# EAGLE schematic E-cabinet (EAGLE 6.6.0)
AUFTRAGS_NR: EL-Dummy; BEARBEITET: J.Strassesr; DATUM: 23.01.2016; ERSTELLER: J.Strasser

## Sheet 1 of 3
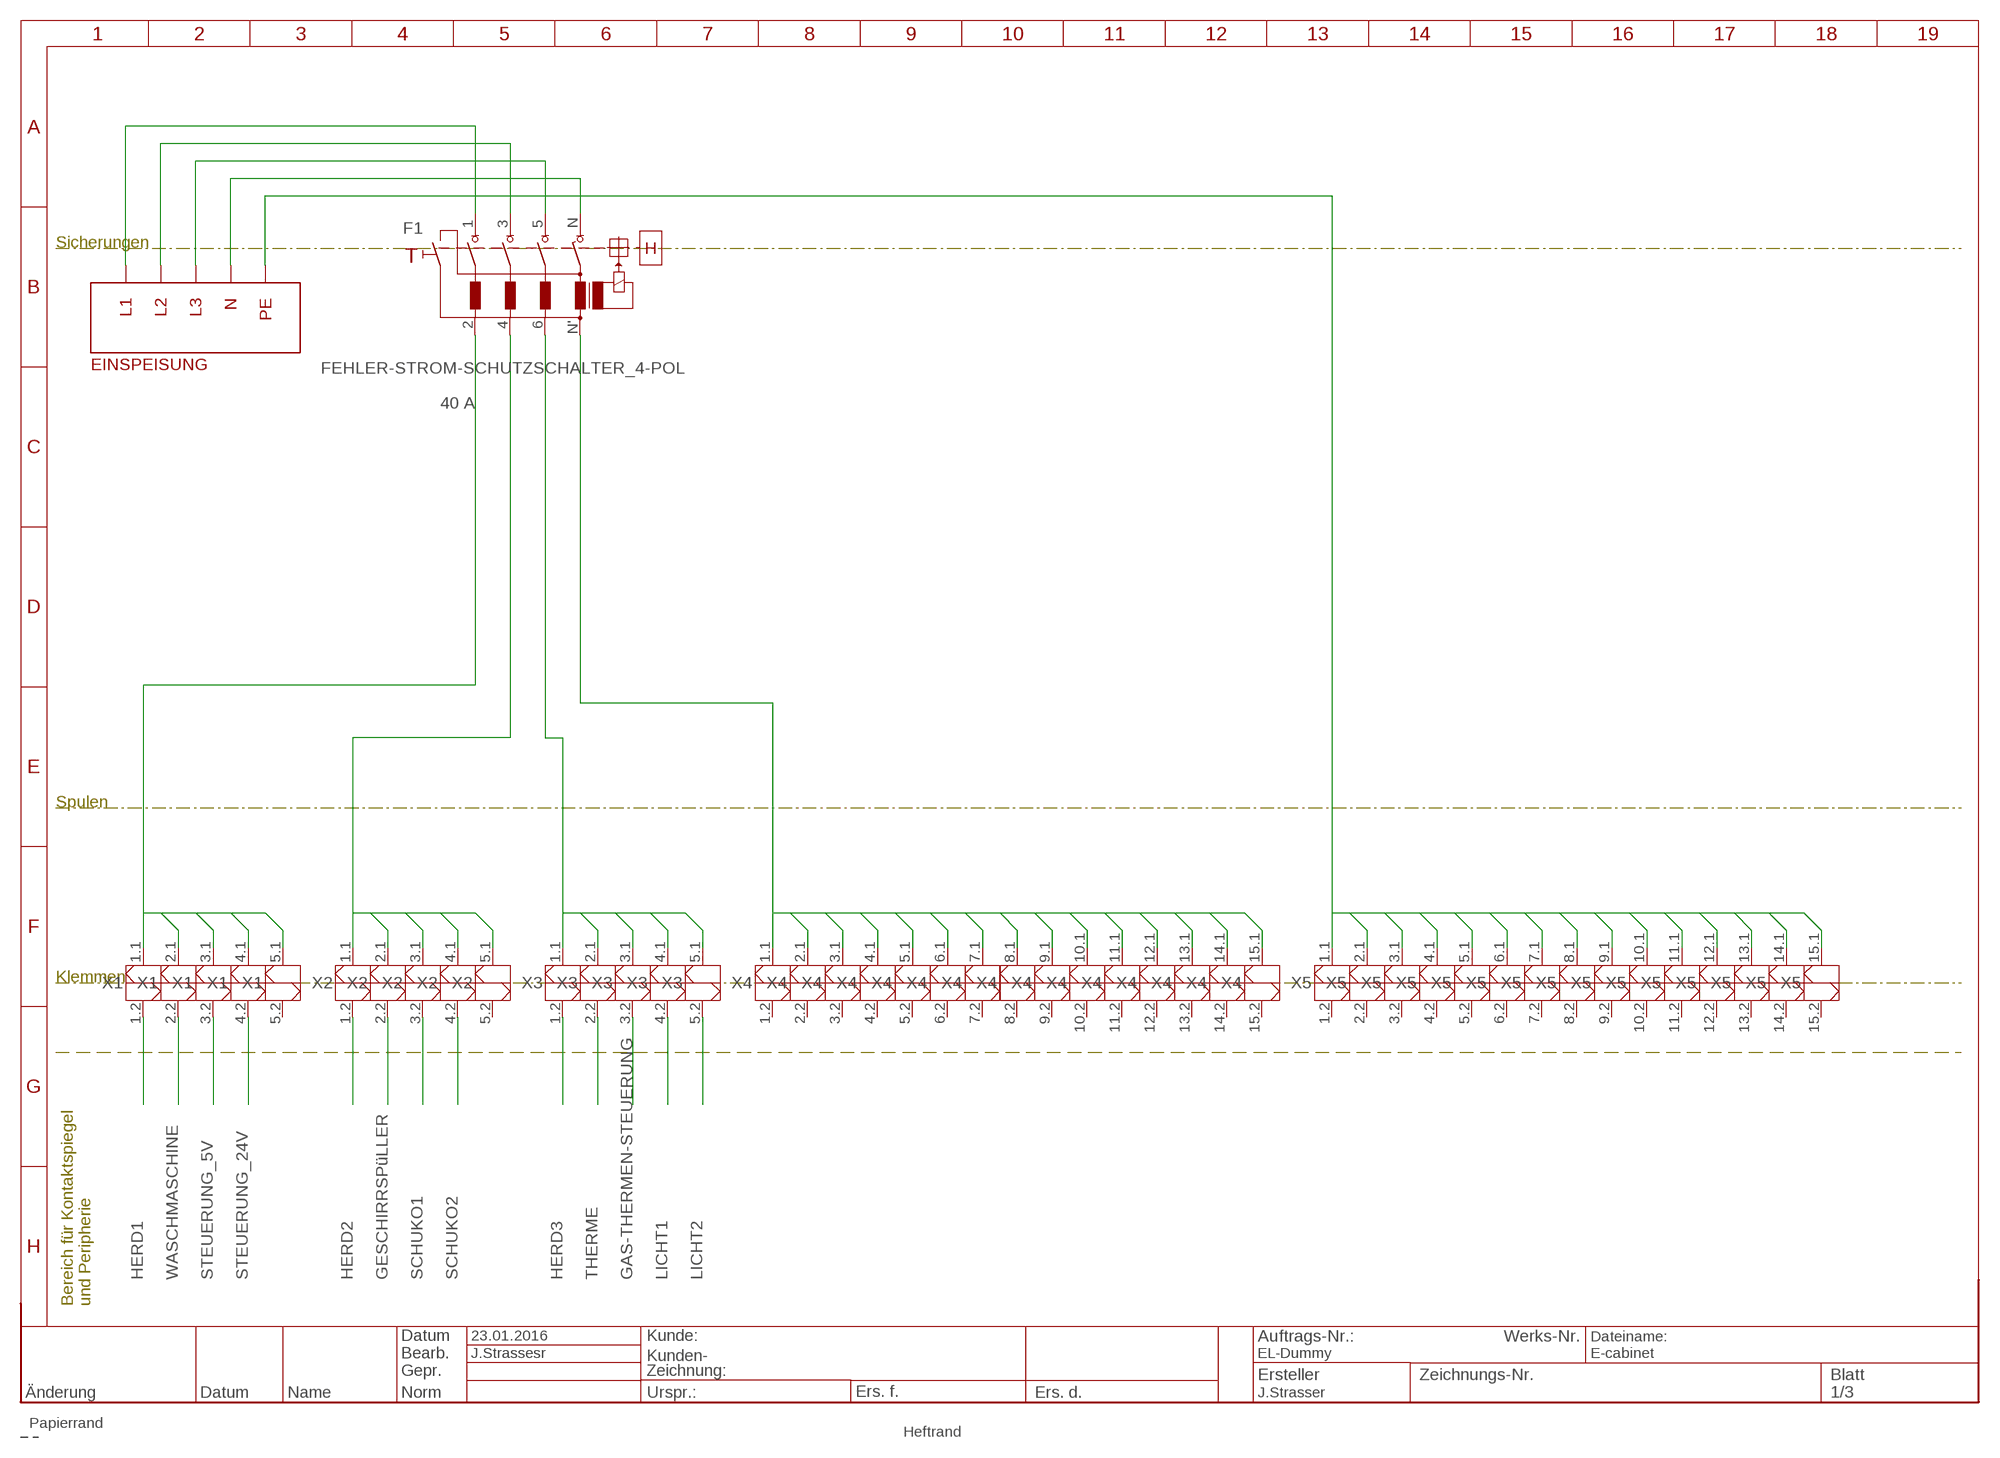
[diagram p0: schematic, sheet 1]

### Parts
F1  FEHLER-STROM-SCHUTZSCHALTER_4-POL  [FEHLER-STROM-SCHUTZSCHALTER_4-POL]
X1  KLEMME-2_5-BRUECKE  [KLEMME-2_5-BRUECKE]
X2  KLEMME-2_5-BRUECKE  [KLEMME-2_5-BRUECKE]
X3  KLEMME-2_5-BRUECKE  [KLEMME-2_5-BRUECKE]
X4  KLEMME-2_15-BRUECKE  [KLEMME-2_15-BRUECKE]
X5  KLEMME-2_15-BRUECKE  [KLEMME-2_15-BRUECKE]

### Nets
GAS-THERMEN-STEUERUNG: X3.3.2 ; also sheet 2
GESCHIRRSPüLLER: X2.2.2 ; also sheet 2
HERD1: X1.1.2 ; also sheet 2
HERD2: X2.1.2 ; also sheet 2
HERD3: X3.1.2 ; also sheet 2
L1: F1.2 X1.1.1 X1.2.1 X1.3.1 X1.4.1 X1.5.1
L1-EXT: F1.1
L2: F1.4 X2.1.1 X2.2.1 X2.3.1 X2.4.1 X2.5.1
L2-EXT: F1.3
L3-EXT: F1.5
LICHT1: X3.4.2 ; also sheet 2
LICHT2: X3.5.2 ; also sheet 2
N: F1.N' X4.1.1 X4.2.1 X4.3.1 X4.4.1 X4.5.1 X4.6.1 X4.7.1 X4.8.1 X4.9.1 X4.10.1 X4.11.1 X4.12.1 X4.13.1 X4.14.1 X4.15.1 ; also sheet 2
N$1: F1.6 X3.1.1 X3.2.1 X3.3.1 X3.4.1 X3.5.1
N-EXT: F1.N
PE-EXT: X5.1.1 X5.2.1 X5.3.1 X5.4.1 X5.5.1 X5.6.1 X5.7.1 X5.8.1 X5.9.1 X5.10.1 X5.11.1 X5.12.1 X5.13.1 X5.14.1 X5.15.1
SCHUKO1: X2.3.2 ; also sheet 2
SCHUKO2: X2.4.2 ; also sheet 2
STEUERUNG_5V: X1.3.2 ; also sheet 2
STEUERUNG_24V: X1.4.2 ; also sheet 2
THERME: X3.2.2 ; also sheet 2
WASCHMASCHINE: X1.2.2 ; also sheet 2
Unconnected: X1.5.2 X2.5.2 X4.1.2 X4.2.2 X4.3.2 X4.4.2 X4.5.2 X4.6.2 X4.7.2 X4.8.2 X4.9.2 X4.10.2 X4.11.2 X4.12.2 X4.13.2 X4.14.2 X4.15.2 X5.1.2 X5.2.2 X5.3.2 X5.4.2 X5.5.2 X5.6.2 X5.7.2 X5.8.2 X5.9.2 X5.10.2 X5.11.2 X5.12.2 X5.13.2 X5.14.2 X5.15.2

## Sheet 2 of 3
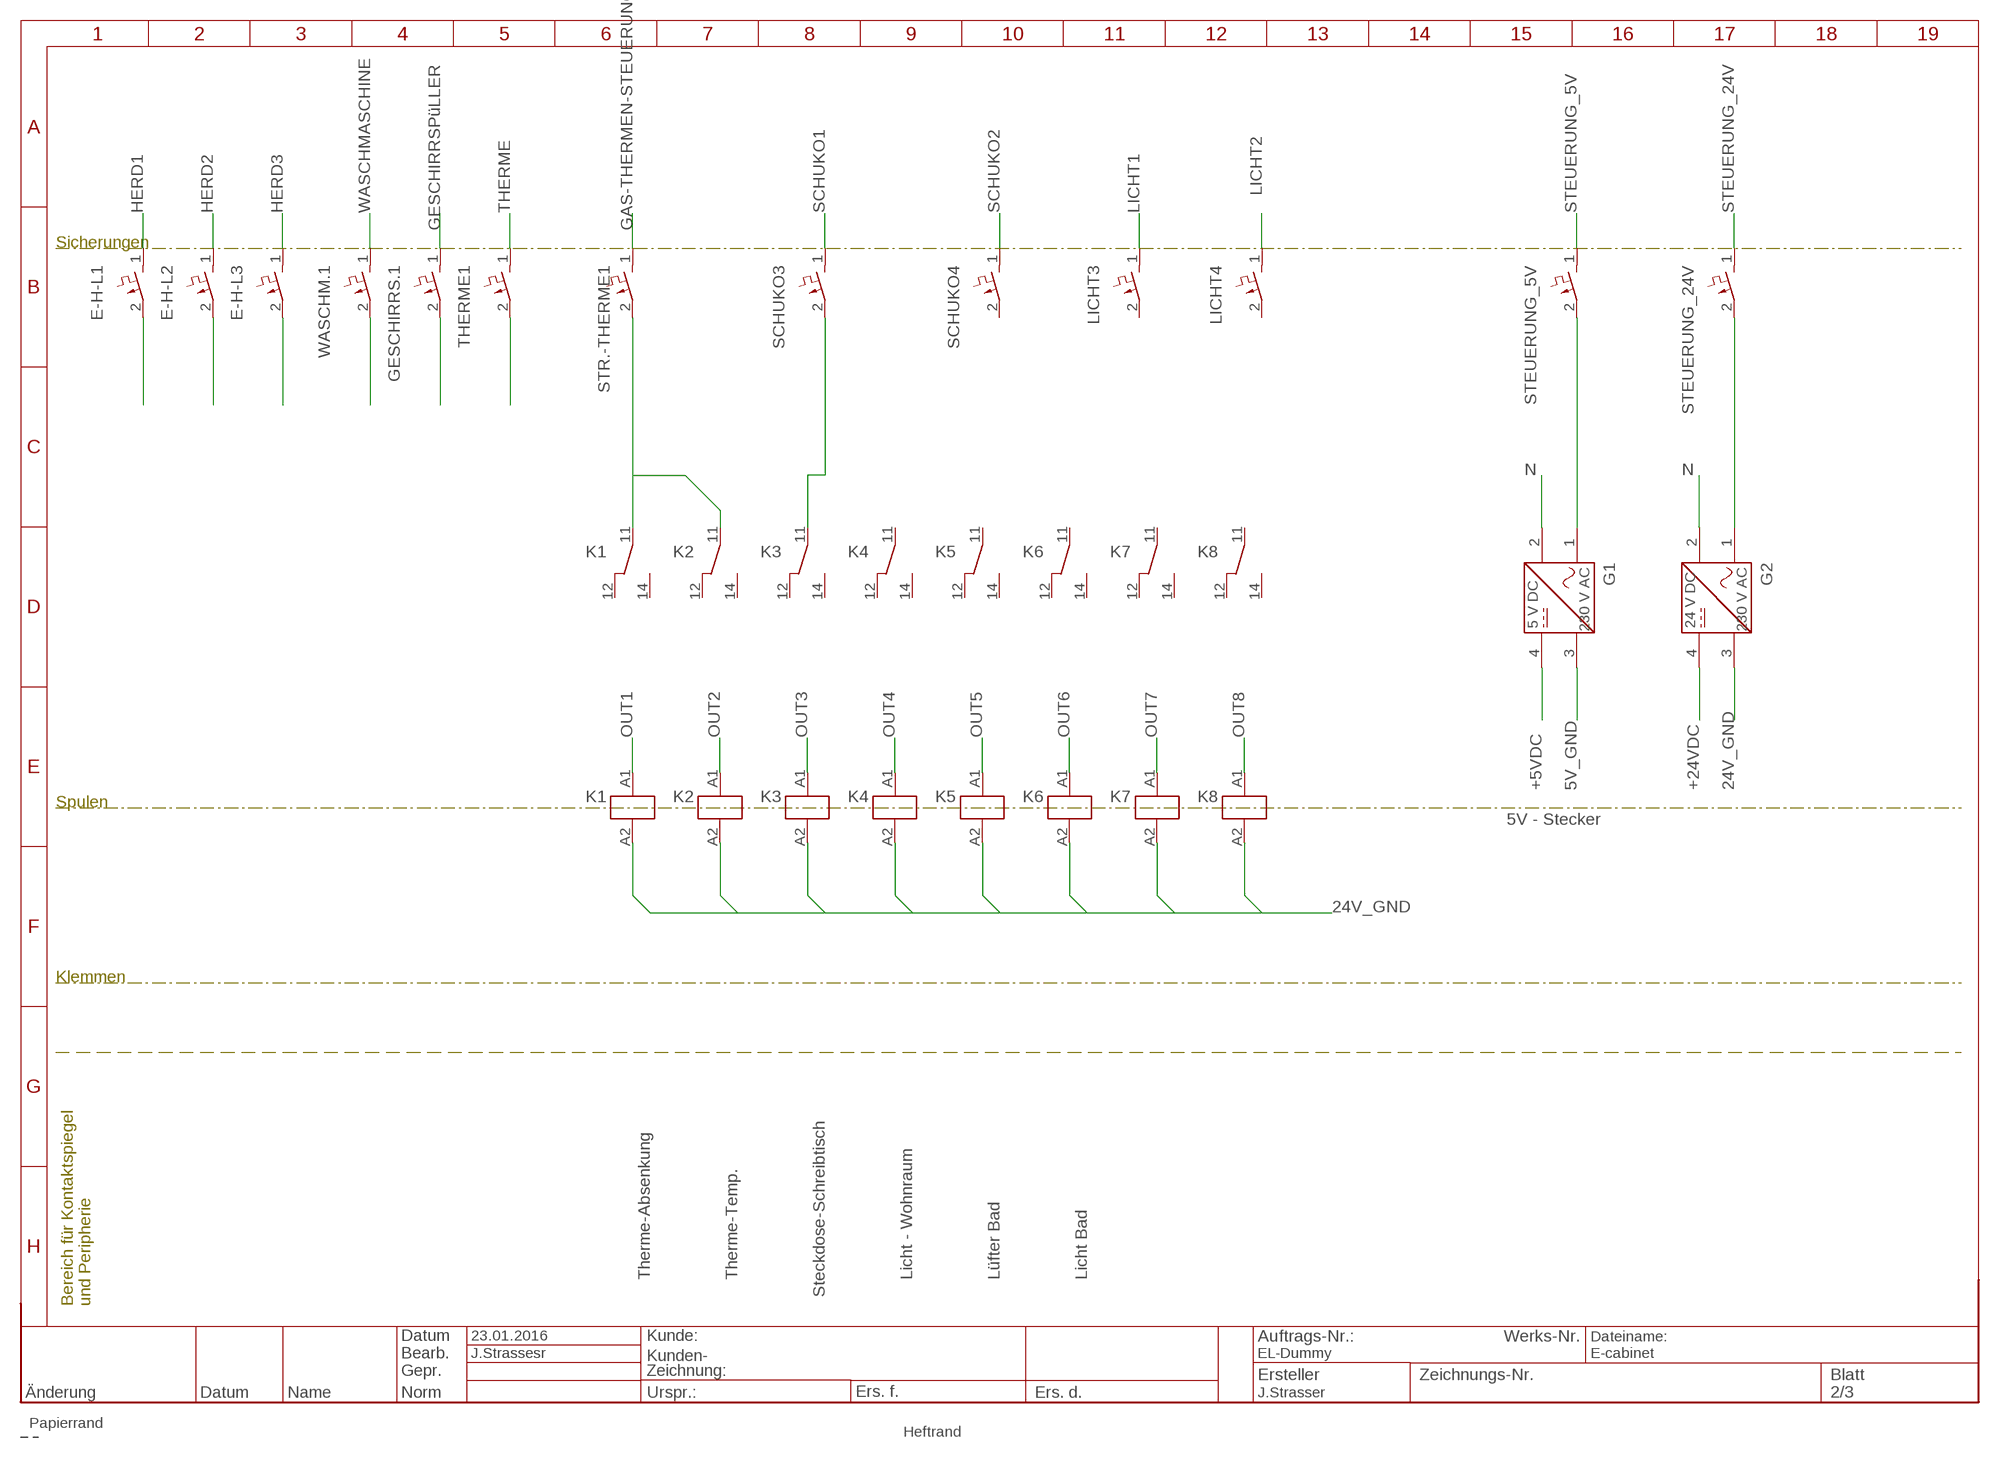
[diagram p1: schematic, sheet 2]

### Parts
E-H-L1  LEITUNGSSCHUTZSCHALTER  [LEITUNGSSCHUTZSCHALTER]
E-H-L2  LEITUNGSSCHUTZSCHALTER  [LEITUNGSSCHUTZSCHALTER]
E-H-L3  LEITUNGSSCHUTZSCHALTER  [LEITUNGSSCHUTZSCHALTER]
G1  NETZTEIL_GLEICHSPANNUNG  [NETZTEIL_GLEICHSPANNUNG]
G2  NETZTEIL_GLEICHSPANNUNG  [NETZTEIL_GLEICHSPANNUNG]
GESCHIRRS.1  LEITUNGSSCHUTZSCHALTER  [LEITUNGSSCHUTZSCHALTER]
K1  HILFSSCHUETZ_11-12-14  [HILFSSCHUETZ_11-12-14]
K2  HILFSSCHUETZ_11-12-14  [HILFSSCHUETZ_11-12-14]
K3  HILFSSCHUETZ_11-12-14  [HILFSSCHUETZ_11-12-14]
K4  HILFSSCHUETZ_11-12-14  [HILFSSCHUETZ_11-12-14]
K5  HILFSSCHUETZ_11-12-14  [HILFSSCHUETZ_11-12-14]
K6  HILFSSCHUETZ_11-12-14  [HILFSSCHUETZ_11-12-14]
K7  HILFSSCHUETZ_11-12-14  [HILFSSCHUETZ_11-12-14]
K8  HILFSSCHUETZ_11-12-14  [HILFSSCHUETZ_11-12-14]
LICHT3  LEITUNGSSCHUTZSCHALTER  [LEITUNGSSCHUTZSCHALTER]
LICHT4  LEITUNGSSCHUTZSCHALTER  [LEITUNGSSCHUTZSCHALTER]
SCHUKO3  LEITUNGSSCHUTZSCHALTER  [LEITUNGSSCHUTZSCHALTER]
SCHUKO4  LEITUNGSSCHUTZSCHALTER  [LEITUNGSSCHUTZSCHALTER]
STEUERUNG_5V  LEITUNGSSCHUTZSCHALTER  [LEITUNGSSCHUTZSCHALTER]
STEUERUNG_24V  LEITUNGSSCHUTZSCHALTER  [LEITUNGSSCHUTZSCHALTER]
STR.-THERME1  LEITUNGSSCHUTZSCHALTER  [LEITUNGSSCHUTZSCHALTER]
THERME1  LEITUNGSSCHUTZSCHALTER  [LEITUNGSSCHUTZSCHALTER]
WASCHM.1  LEITUNGSSCHUTZSCHALTER  [LEITUNGSSCHUTZSCHALTER]

### Nets
5V_GND: G1.3 ; also sheet 3
24V_GND: G2.3 K1.A2(0:A2) K2.A2(0:A2) K3.A2(0:A2) K4.A2(0:A2) K5.A2(0:A2) K6.A2(0:A2) K7.A2(0:A2) K8.A2(0:A2) ; also sheet 3
+5VDC: G1.4 ; also sheet 3
+24VDC: G2.4 ; also sheet 3
GAS-THERMEN-STEUERUNG: STR.-THERME1.1 ; also sheet 1
GESCHIRRSPüLLER: GESCHIRRS.1.1 ; also sheet 1
HERD1: E-H-L1.1 ; also sheet 1
HERD2: E-H-L2.1 ; also sheet 1
HERD3: E-H-L3.1 ; also sheet 1
LICHT1: LICHT3.1 ; also sheet 1
LICHT2: LICHT4.1 ; also sheet 1
N: G1.2 G2.2 ; also sheet 1
N$2: WASCHM.1.2
N$3: GESCHIRRS.1.2
N$4: THERME1.2
N$5: E-H-L1.2
N$6: E-H-L2.2
N$7: E-H-L3.2
N$8: K1.11 K2.11 STR.-THERME1.2
N$9: G1.1 STEUERUNG_5V.2
N$10: G2.1 STEUERUNG_24V.2
N$11: K3.11 SCHUKO3.2
OUT1: K1.A1(0:A1) ; also sheet 3
OUT2: K2.A1(0:A1) ; also sheet 3
OUT3: K3.A1(0:A1) ; also sheet 3
OUT4: K4.A1(0:A1) ; also sheet 3
OUT5: K5.A1(0:A1) ; also sheet 3
OUT6: K6.A1(0:A1) ; also sheet 3
OUT7: K7.A1(0:A1) ; also sheet 3
OUT8: K8.A1(0:A1) ; also sheet 3
SCHUKO1: SCHUKO3.1 ; also sheet 1
SCHUKO2: SCHUKO4.1 ; also sheet 1
STEUERUNG_5V: STEUERUNG_5V.1 ; also sheet 1
STEUERUNG_24V: STEUERUNG_24V.1 ; also sheet 1
THERME: THERME1.1 ; also sheet 1
WASCHMASCHINE: WASCHM.1.1 ; also sheet 1
Unconnected: K1.12 K1.14 K2.12 K2.14 K3.12 K3.14 K4.11 K4.12 K4.14 K5.11 K5.12 K5.14 K6.11 K6.12 K6.14 K7.11 K7.12 K7.14 K8.11 K8.12 K8.14 LICHT3.2 LICHT4.2 SCHUKO4.2

### Notes on the sheet
- 5V - Stecker
- Therme-Absenkung | Therme-Temp. | Licht - Wohnraum | Lüfter Bad | Licht Bad
- Steckdose-Schreibtisch

## Sheet 3 of 3
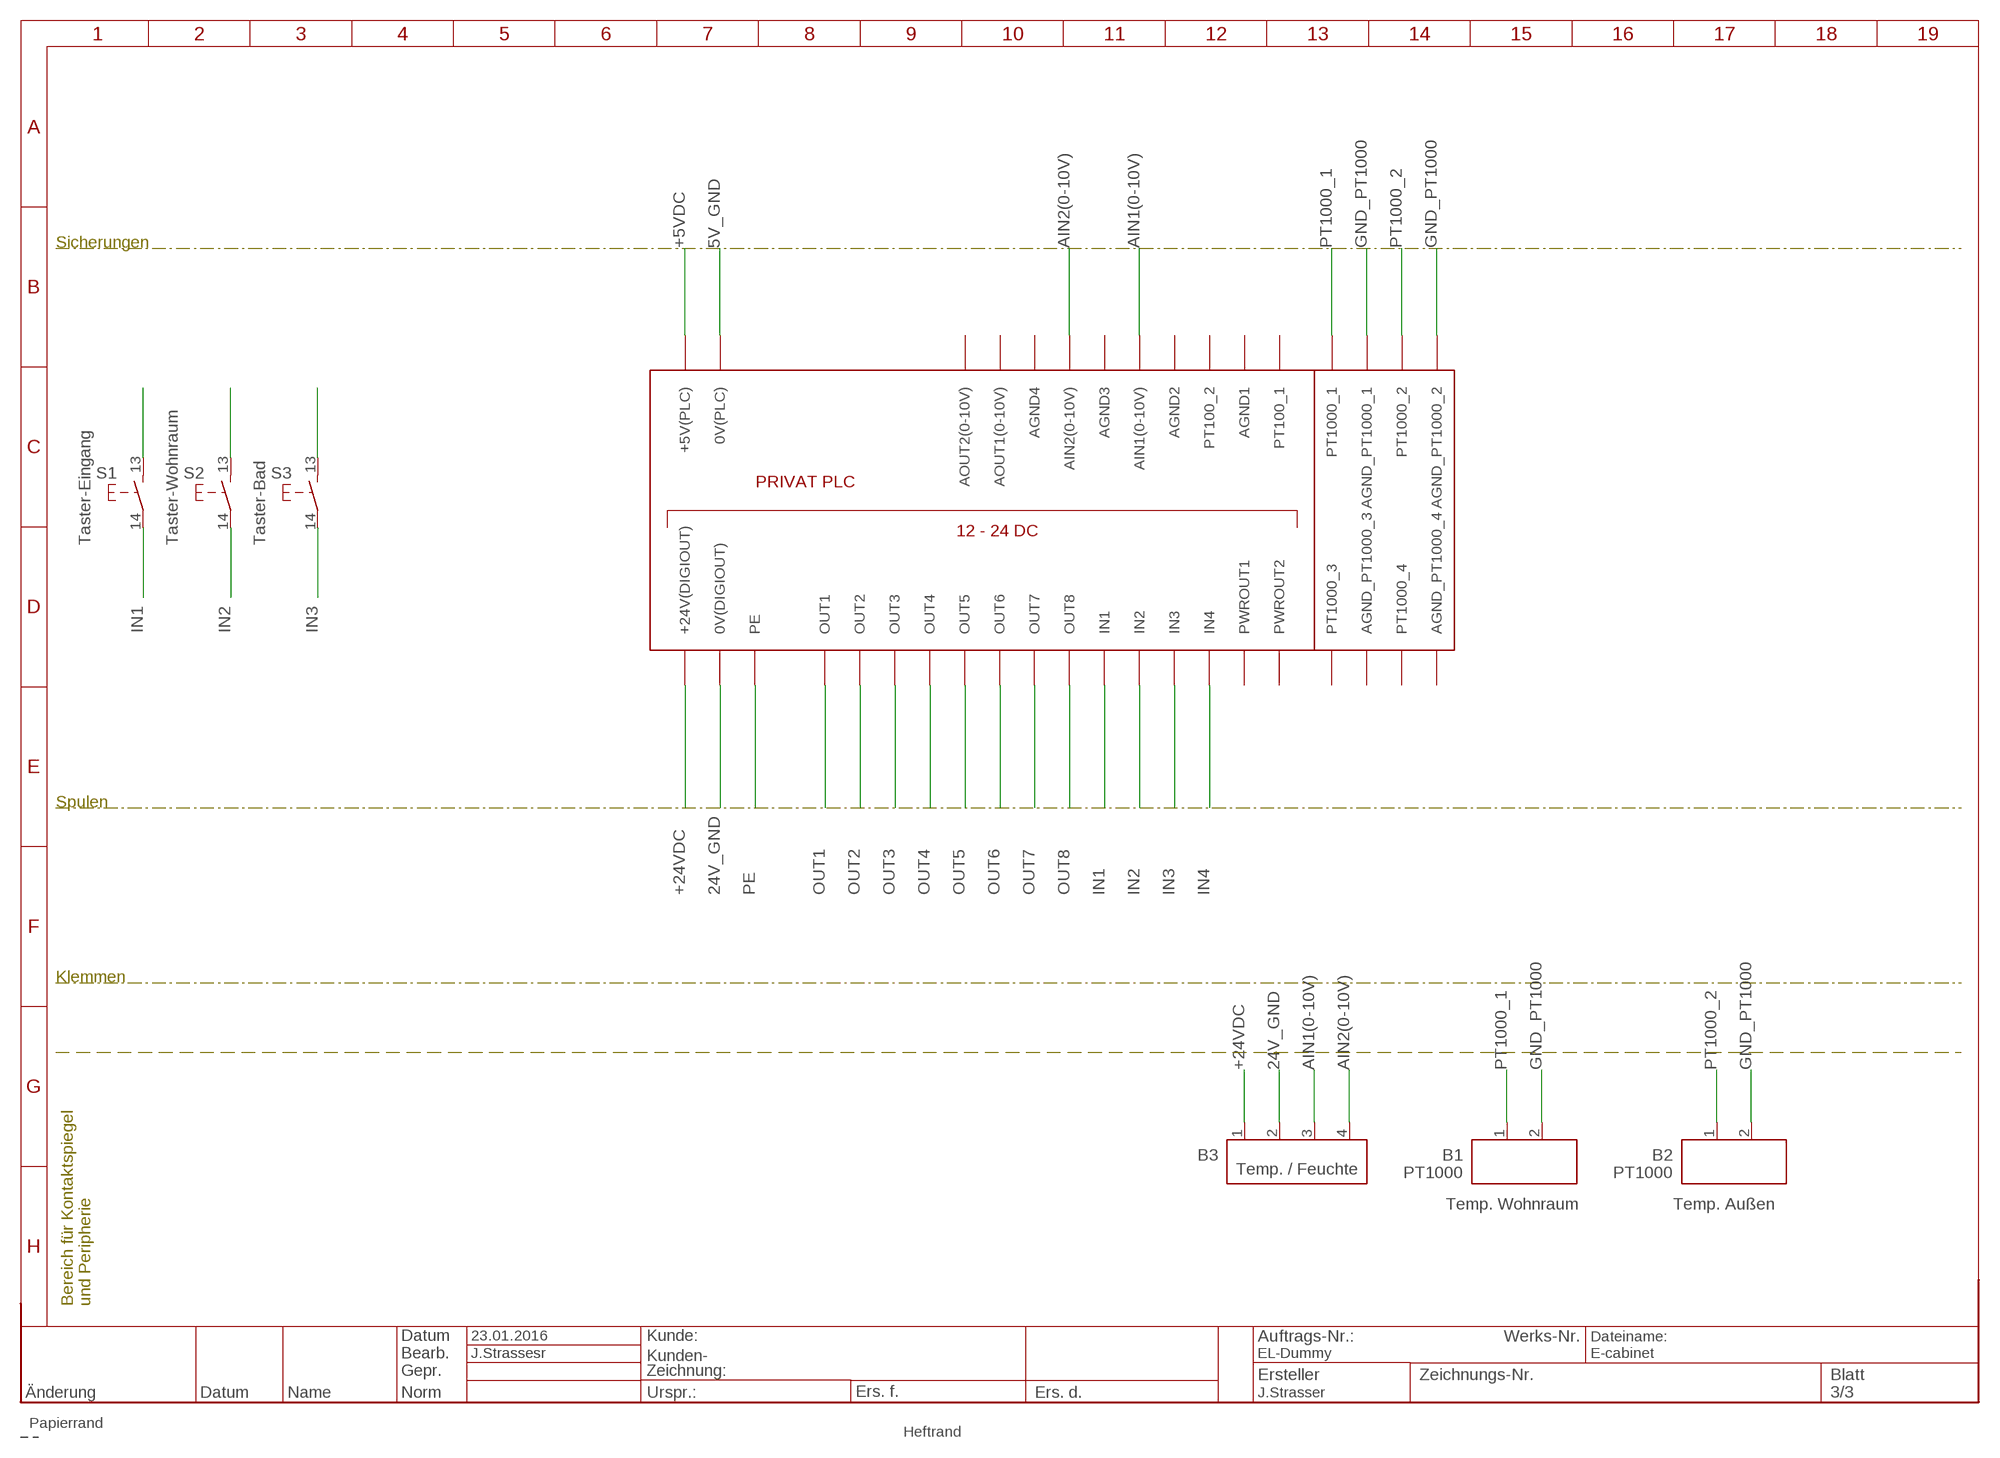
[diagram p2: schematic, sheet 3]

### Parts
B1  MESSFUEHLER_2  [MESSFUEHLER_2]
B2  MESSFUEHLER_2  [MESSFUEHLER_2]
B3  MESSFUEHLER_4  [MESSFUEHLER_4]
S1  TASTER_SCHLIESSER  [EINTASTER]
S2  TASTER_SCHLIESSER  [EINTASTER]
S3  TASTER_SCHLIESSER  [EINTASTER]
U$1  PRIVATEPLC  [PRIVATEPLC]

### Nets
5V_GND: U$1.P0V(0V(PLC)) ; also sheet 2
24V_GND: B3.2 U$1.0V(0V(DIGIOUT)) ; also sheet 2
+5VDC: U$1.P5V(+5V(PLC)) ; also sheet 2
+24VDC: B3.1 U$1.+24V(+24V(DIGIOUT)) ; also sheet 2
AIN1(0-10V): B3.3 U$1.AIN1(AIN1(0-10V))
AIN2(0-10V): B3.4 U$1.AIN2(AIN2(0-10V))
GND_PT1000: B1.2 B2.2 U$1.AGND_PT1000_1 U$1.AGND_PT1000_2
IN1: S1.14 U$1.IN1
IN2: S2.14 U$1.IN2
IN3: S3.14 U$1.IN3
IN4: U$1.IN4
N$12: S1.13
N$13: S2.13
N$14: S3.13
OUT1: U$1.OUT1 ; also sheet 2
OUT2: U$1.OUT2 ; also sheet 2
OUT3: U$1.OUT3 ; also sheet 2
OUT4: U$1.OUT4 ; also sheet 2
OUT5: U$1.OUT5 ; also sheet 2
OUT6: U$1.OUT6 ; also sheet 2
OUT7: U$1.OUT7 ; also sheet 2
OUT8: U$1.OUT8 ; also sheet 2
PE: U$1.PE
PT1000_1: B1.1 U$1.PT1000_1
PT1000_2: B2.1 U$1.PT1000_2
Unconnected: U$1.AGND1 U$1.AGND2 U$1.AGND3 U$1.AGND4 U$1.AGND_PT1000_3 U$1.AGND_PT1000_4 U$1.AOUT1(AOUT1(0-10V)) U$1.AOUT2(AOUT2(0-10V)) U$1.PT100_1 U$1.PT100_2 U$1.PT1000_3 U$1.PT1000_4

### Notes on the sheet
- Taster-Eingang | Taster-Wohnraum | Taster-Bad

## Power pins joined to a net without a drawn wire
PWROUT1: U$1.PWROUT1
PWROUT2: U$1.PWROUT2

## Library data of the parts
B1 = e-messfuehler:MESSFUEHLER_2: Messfühler mit zwei Anschlüssen; FUNKTION: Temp. Wohnraum; TYPE: PT1000
B2 = e-messfuehler:MESSFUEHLER_2: Messfühler mit zwei Anschlüssen; FUNKTION: Temp. Außen; TYPE: PT1000
B3 = e-messfuehler:MESSFUEHLER_4: Messfühler mit vier Anschlüssen, 2 Versorgung, 2 Signal; FUNKTION: Temp. / Feuchte
E-H-L1-E-H-L3 GESCHIRRS.1 LICHT3 LICHT4 SCHUKO3 SCHUKO4 STEUERUNG_5V STEUERUNG_24V STR.-THERME1 THERME1 WASCHM.1 = e-sicherungen:LEITUNGSSCHUTZSCHALTER: Sicherung
F1 = e-sicherungen:FEHLER-STROM-SCHUTZSCHALTER_4-POL: Fehlerstromschutzschalter (FI) 4-pol mit Prüftaster; FUNKTION: 40 A
G1 = e-stromversorgungselemente:NETZTEIL_GLEICHSPANNUNG: Netzteil, Gleichspannung; AUSGANGSSPANNUNG: 5 V DC; EINGANGSSPANNUNG: 230 V AC
G2 = e-stromversorgungselemente:NETZTEIL_GLEICHSPANNUNG: Netzteil, Gleichspannung; AUSGANGSSPANNUNG: 24 V DC; EINGANGSSPANNUNG: 230 V AC
K1-K8 = e-schuetze-relais:HILFSSCHUETZ_11-12-14: Hilfsschütz mit Wechselkontakt
S1-S3 = e-schalter:TASTER_SCHLIESSER: Ein-Taster (Arbeitskontakt)
U$1 = STRASYS_CONTRL:PRIVATEPLC: PRIVATE PLC (Strasys.at) Internet Steuerung 8 x Digital Output, 4 x Digital Input, 2 x PT100, 2 x Analog Out (0-10V), 2 x Analgo IN (0-10V), 2 x Analog OUT (0-10V), 4 x PT1000
X1-X3 = e-klemmen:KLEMME-2_5-BRUECKE: Klemme 5-pol. mit Brückenhinweis
X4 X5 = e-klemmen:KLEMME-2_15-BRUECKE: Klemme 15-pol. mit Brückenhinweis